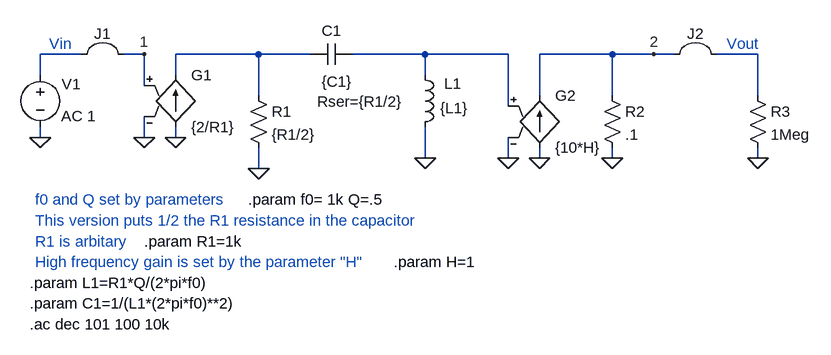
[diagram p0: schematic 2ndOrderHighpass.asc]
2ndOrderHighpass.asc, the LTspice schematic file:
Version 4
SHEET 1 1060 680
WIRE -560 -128 -624 -128
WIRE -464 -128 -496 -128
WIRE -288 -128 -416 -128
WIRE -208 -128 -288 -128
WIRE -32 -128 -144 -128
WIRE 96 -128 -32 -128
WIRE 256 -128 144 -128
WIRE 320 -128 256 -128
WIRE 352 -128 320 -128
WIRE 480 -128 416 -128
WIRE -624 -96 -624 -128
WIRE -416 -96 -416 -128
WIRE -32 -96 -32 -128
WIRE -464 -80 -464 -128
WIRE -288 -64 -288 -128
WIRE 144 -64 144 -128
WIRE 256 -64 256 -128
WIRE 480 -64 480 -128
WIRE 96 -48 96 -128
WIRE -624 0 -624 -16
WIRE -464 0 -464 -32
WIRE -416 0 -416 -16
WIRE -32 32 -32 -16
WIRE 96 32 96 0
WIRE 144 32 144 16
WIRE 256 32 256 16
WIRE 480 32 480 16
WIRE -288 48 -288 16
FLAG -32 32 0
FLAG -288 48 0
FLAG -416 0 0
FLAG -464 0 0
FLAG 96 32 0
FLAG 144 32 0
FLAG 256 32 0
FLAG 320 -128 2
FLAG -464 -128 1
FLAG -624 0 0
FLAG 480 32 0
SYMBOL ind -48 -112 R0
WINDOW 0 59 45 Bottom 2
WINDOW 3 61 51 Top 2
SYMATTR InstName L1
SYMATTR Value {L1}
SYMBOL cap -208 -112 R270
WINDOW 0 52 17 VRight 2
WINDOW 3 -26 17 VRight 2
WINDOW 123 -57 10 VRight 2
SYMATTR InstName C1
SYMATTR Value {C1}
SYMATTR Value2 Rser={R1/2}
SYMBOL g -416 -112 R0
SYMATTR InstName G1
SYMATTR Value {2/R1}
SYMBOL res -304 -80 R0
SYMATTR InstName R1
SYMATTR Value {R1/2}
SYMBOL g 144 -80 R0
SYMATTR InstName G2
SYMATTR Value {10*H}
SYMBOL res 240 -80 R0
SYMATTR InstName R2
SYMATTR Value .1
SYMBOL Misc\\jumper 384 -192 R0
SYMATTR InstName J2
SYMBOL Misc\\jumper -528 -192 M0
SYMATTR InstName J1
SYMBOL voltage -624 -112 R0
WINDOW 0 33 30 Left 2
WINDOW 123 32 79 Left 2
WINDOW 39 0 0 Left 0
SYMATTR InstName V1
SYMATTR Value2 AC 1
SYMATTR Value ""
SYMBOL res 464 -80 R0
SYMATTR InstName R3
SYMATTR Value 1Meg
TEXT -304 96 Left 2 !.param f0= 1k Q=.5
TEXT -464 160 Left 2 !.param R1=1k
TEXT -640 224 Left 2 !.param L1=R1*Q/(2*pi*f0)
TEXT -632 96 Left 2 ;f0 and Q set by parameters
TEXT -632 160 Left 2 ;R1 is arbitary
TEXT -632 128 Left 2 ;This version puts 1/2 the R1 resistance in the capacitor
TEXT -640 256 Left 2 !.param C1=1/(L1*(2*pi*f0)**2)
TEXT 432 -144 Left 2 ;Vout
TEXT -576 -144 Right 2 ;Vin
TEXT -632 192 Left 2 ;High frequency gain is set by the parameter "H"
TEXT -80 192 Left 2 !.param H=1
TEXT -640 288 Left 2 !.ac dec 101 100 10k

The netlist it stands for:
* 2ndOrderHighpass.asc
L1 N002 0 {L1}
C1 N001 N002 {C1} Rser={R1/2}
G1 0 N001 1 0 {2/R1}
R1 N001 0 {R1/2}
G2 0 2 N002 0 {10*H}
R2 2 0 .1
V1 1 0 AC 1
R3 2 0 1Meg
.param f0= 1k Q=.5
.param R1=1k
.param L1=R1*Q/(2*pi*f0)
* f0 and Q set by parameters
* R1 is arbitary
* This version puts 1/2 the R1 resistance in the capacitor
.param C1=1/(L1*(2*pi*f0)**2)
* Vout
* Vin
* High frequency gain is set by the parameter "H"
.param H=1
.ac dec 101 100 10k
.backanno
.end